# Altium schematic sheet RELAY3.SchDoc
size A
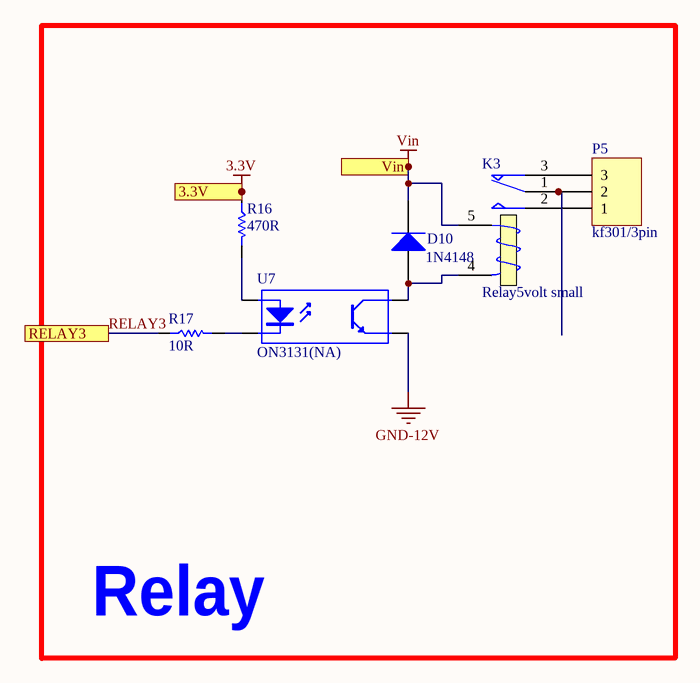
[diagram p0: RELAY3.SchDoc]

## Parts
D10  1N4148  [sod123]
K3  Relay5volt small  [relay5_childern]
P5  kf301/3pin  [Blue Connector 1*3 -kf301]
R16  470R  [0805/resistor]
R17  10R  [0805/resistor]
U7  ON3131(NA)  [OPTO_COUPLER]

## Blocks framed on the sheet
Relay: D10 K3 P5 R16 R17 U7

## Ports
3.3V, RELAY3, Vin

## Nets
3.3V: R16.1 ; port 3.3V
GND-12V: U7.3(E)
Vin: D10.K K3.5 ; port Vin
RELAY3: R17.1 ; port RELAY3
NetD10_A: D10.A K3.4(T2) U7.4(C)
NetK3_1: K3.1(COM) P5.2
NetK3_2: K3.2(NO) P5.1
NetK3_3: K3.3(T1) P5.3
NetR16_2: R16.2 U7.1(A)
NetR17_2: R17.2 U7.2(K)

## Library data of the parts
D10 = Diode 1N4007: 1 Amp General Purpose Rectifier; Published: 8-Jun-2000; LatestRevisionDate: 17-Jul-2002; LatestRevisionNote: Re-released for DXP Platform.; DatasheetVersion: 1998; PackageVersion: Aug-1999; PackageReference: DO-41; Publisher: Altium Limited; PackageDescription: Diode, Axial; Body 5.2 x 2.7 mm (LxDia. max), Lead Dia. 0.86 mm (max); Code_JEDEC: DO-204-AL; ComponentLink1Description: Manufacturer Link; ComponentLink1URL: http://www.fairchildsemi.com/; ComponentLink2Description: Datasheet; ComponentLink2URL: http://www.fairchildsemi.com/ds/1N%2F1N4001.pdf
K3 = Relay: SPDT Relay; Published: 8-Jun-2000; LatestRevisionDate: 17-Jul-2002; LatestRevisionNote: Re-released for DXP Platform.; PackageReference: MODULE5B; Publisher: Altium Limited
P5 = Header 3: LatestRevisionDate: 17-Jul-2002; LatestRevisionNote: Re-released for DXP Platform.; Publisher: Altium Limited
R16 R17 = Resistor: Tolerance: 5%; Power: 1/8 W
  R16: Value: 470R
  R17: Value: 10R
U7 = Optoisolator1: 4-Pin Phototransistor Optocoupler; Published: 24-Mar-1999; LatestRevisionDate: 04-Mar-2005; LatestRevisionNote: Sch pins 3 & 4 Swapped.; DatasheetVersion: Nov-2003; PackageReference: DIP-4; Publisher: Altium Limited